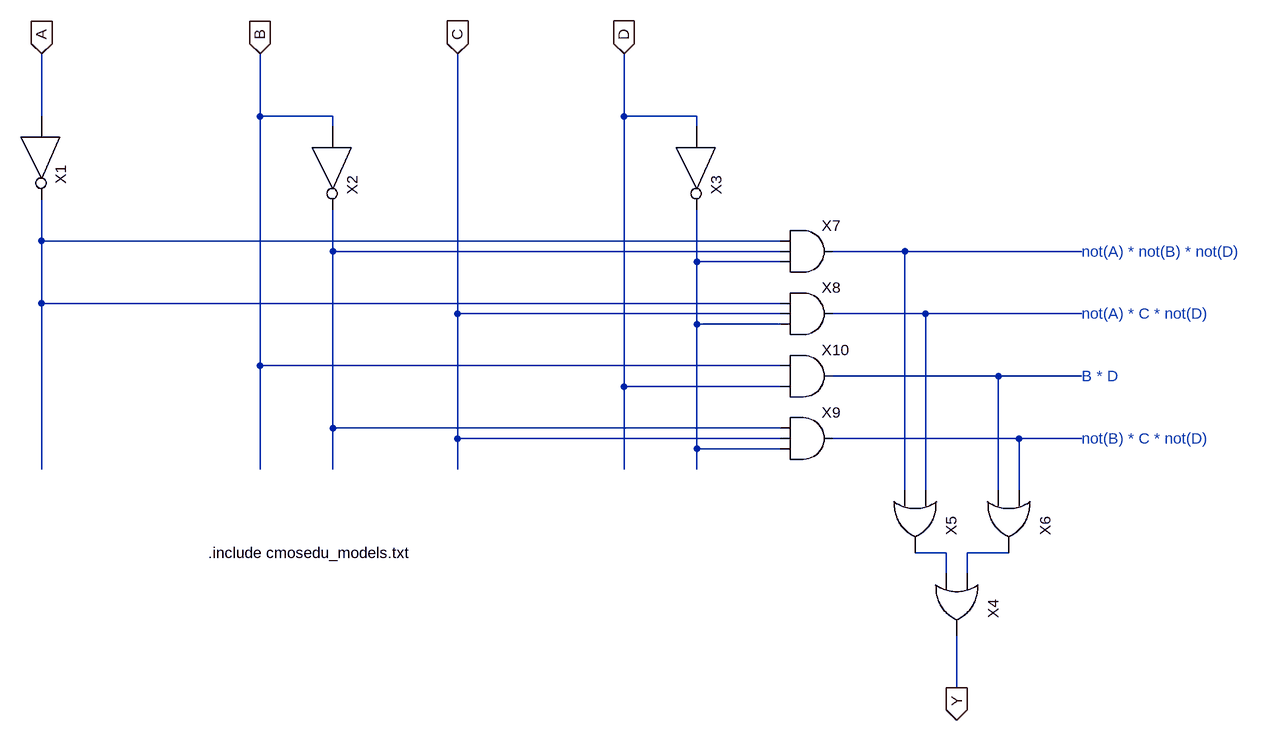
[diagram p0: schematic fonction-logique.asc]
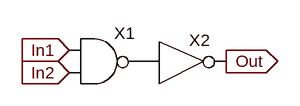
[diagram p1: sub-circuit and2.asc]
fonction-logique.asc, the LTspice schematic file:
Version 4
SHEET 1 1532 876
WIRE -352 -80 -352 -176
WIRE -16 -80 -16 -176
WIRE 96 -80 -16 -80
WIRE 544 -80 544 -176
WIRE 656 -80 544 -80
WIRE 96 -64 96 -80
WIRE 656 -64 656 -80
WIRE -352 112 -352 48
WIRE 784 112 -352 112
WIRE 96 128 96 64
WIRE 784 128 96 128
WIRE 976 128 864 128
WIRE 1248 128 976 128
WIRE 656 144 656 64
WIRE 784 144 656 144
WIRE -352 208 -352 112
WIRE 784 208 -352 208
WIRE 288 224 288 -176
WIRE 784 224 288 224
WIRE 1008 224 864 224
WIRE 1248 224 1008 224
WIRE 656 240 656 144
WIRE 784 240 656 240
WIRE -16 304 -16 -80
WIRE 784 304 -16 304
WIRE 1120 320 864 320
WIRE 1248 320 1120 320
WIRE 544 336 544 -80
WIRE 784 336 544 336
WIRE 96 400 96 128
WIRE 784 400 96 400
WIRE 288 416 288 224
WIRE 784 416 288 416
WIRE 1152 416 864 416
WIRE 1248 416 1152 416
WIRE 656 432 656 240
WIRE 784 432 656 432
WIRE -352 464 -352 208
WIRE -16 464 -16 304
WIRE 96 464 96 400
WIRE 288 464 288 416
WIRE 544 464 544 336
WIRE 656 464 656 432
WIRE 976 496 976 128
WIRE 1008 496 1008 224
WIRE 1120 496 1120 320
WIRE 1152 496 1152 416
WIRE 1040 592 992 592
WIRE 1136 592 1072 592
WIRE 1040 624 1040 592
WIRE 1072 624 1072 592
WIRE 1056 800 1056 720
FLAG -352 -176 A
IOPIN -352 -176 In
FLAG -16 -176 B
IOPIN -16 -176 In
FLAG 288 -176 C
IOPIN 288 -176 In
FLAG 544 -176 D
IOPIN 544 -176 In
FLAG 1056 800 Y
IOPIN 1056 800 Out
SYMBOL NOT -320 -48 R90
SYMATTR InstName X1
SYMBOL NOT 128 -32 R90
SYMATTR InstName X2
SYMBOL NOT 688 -32 R90
SYMATTR InstName X3
SYMBOL OR2 1120 672 R90
SYMATTR InstName X4
SYMBOL OR2 1056 544 R90
SYMATTR InstName X5
SYMBOL OR2 1200 544 R90
SYMATTR InstName X6
SYMBOL AND3 832 64 R0
SYMATTR InstName X7
SYMBOL AND3 832 160 R0
SYMATTR InstName X8
SYMBOL AND3 832 352 R0
SYMATTR InstName X9
SYMBOL AND2 832 256 R0
SYMATTR InstName X10
TEXT -96 592 Left 2 !.include cmosedu_models.txt
TEXT 1248 128 Left 2 ;not(A) * not(B) * not(D)
TEXT 1248 224 Left 2 ;not(A) * C * not(D)
TEXT 1248 320 Left 2 ;B * D
TEXT 1248 416 Left 2 ;not(B) * C * not(D)

and2.asc, the sub-circuit schematic file:
Version 4
SHEET 1 1136 680
FLAG 592 272 Out
IOPIN 592 272 Out
FLAG 368 256 In1
IOPIN 368 256 In
FLAG 368 288 In2
IOPIN 368 288 In
SYMBOL NAND2 416 208 R0
SYMATTR InstName X1
SYMBOL NOT 496 240 R0
SYMATTR InstName X2

The netlist it stands for:
* fonction-logique.asc
XX1 A N001 NOT  ; pins In Out
XX2 B N002 NOT  ; pins In Out
XX3 D N004 NOT  ; pins In Out
XX4 N009 N008 Y OR2  ; pins In1 In2 Out
XX5 N005 N003 N008 OR2  ; pins In1 In2 Out
XX6 N007 N006 N009 OR2  ; pins In1 In2 Out
XX7 N001 N004 N003 N002 AND3  ; pins In1 In3 Out In2
XX8 N001 N004 N005 C AND3  ; pins In1 In3 Out In2
XX9 N002 N004 N007 C AND3  ; pins In1 In3 Out In2
XX10 B D N006 and2

* block symbol definitions
.subckt and2 In1 In2 Out
XX1 In1 In2 P001 NAND2  ; pins In1 In2 Out
XX2 P001 Out NOT  ; pins In Out
.ends and2

.include cmosedu_models.txt
* not(A) * not(B) * not(D)
* not(A) * C * not(D)
* B * D
* not(B) * C * not(D)
.backanno
.end